# EAGLE schematic tiny2313 (EAGLE 6.5.0)
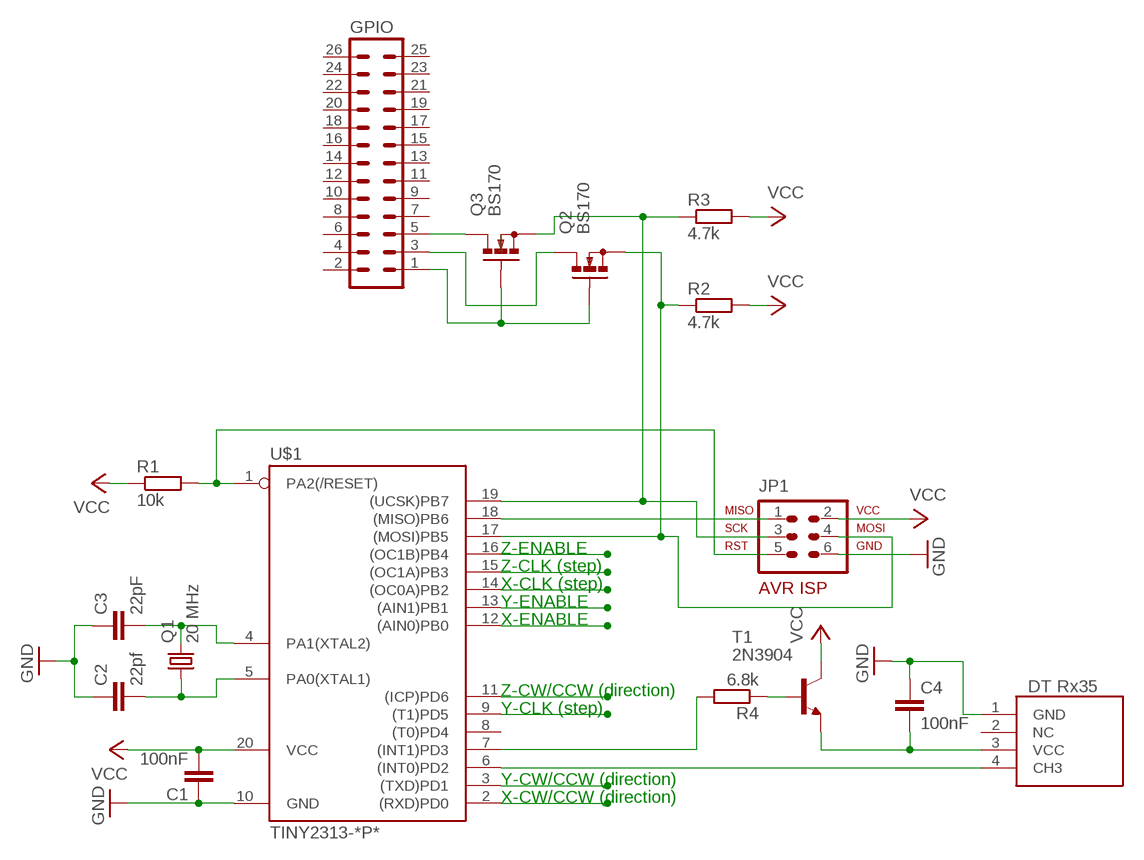
[diagram p0: schematic, sheet 1]

## Parts
C1  100nF  C2.5/2  [C2.5-2]
C2  22pf  C2.5/2  [C2.5-2]
C3  22pF  C2.5/2  [C2.5-2]
C4  100nF  C2.5/2  [C2.5-2]
GPIO  ML26  [ML26]
JP1  AVR-ISP-6VERT  [AVR-ISP-6]
Q1  20 MHz  CRYSTALHC49S  [HC49/S]
Q2  BS170  [SOT54E]
Q3  BS170  [SOT54E]
R1  10k  R-EU_0207/2V  [0207/2V]
R2  4.7k  R-EU_0207/2V  [0207/2V]
R3  4.7k  R-EU_0207/2V  [0207/2V]
R4  6.8k  R-EU_0207/12  [0207/12]
T1  2N3904  [TO92]
U$1  TINY2313-*P*  [DIL20]
U$2  DTRX35  [DTRX35]

## Nets
GND: C1.1 C2.1 C3.1 C4.1 JP1.6 U$1.10(GND) U$2.1(GND)
N$1: JP1.1 U$1.18((MISO)PB6)
N$2: GPIO.5 Q3.D
N$4: GPIO.3 Q2.D
N$5: GPIO.1 Q2.G Q3.G
N$6: U$1.9((T1)PD5)
N$7: U$1.14((OC0A)PB2)
N$8: U$1.15((OC1A)PB3)
N$9: U$1.16((OC1B)PB4)
N$10: U$1.13((AIN1)PB1)
N$11: U$1.12((AIN0)PB0)
N$12: U$1.11((ICP)PD6)
N$13: U$1.3((TXD)PD1)
N$14: U$1.2((RXD)PD0)
N$15: R4.1 T1.2(B)
N$16: JP1.4 Q2.S R2.1 U$1.17((MOSI)PB5)
N$17: C4.2 T1.3(E) U$2.3(VCC)
N$18: R4.2 U$1.7((INT1)PD3)
N$19: C3.2 Q1.2 U$1.4(PA1(XTAL2))
N$20: C2.2 Q1.1 U$1.5(PA0(XTAL1))
N$21: JP1.5 R1.2 U$1.1(PA2(/RESET))
N$22: U$1.6((INT0)PD2) U$2.4(CH3)
N$28: JP1.3 Q3.S R3.1 U$1.19((UCSK)PB7)
VCC: C1.2 JP1.2 R1.1 R2.2 R3.2 T1.1(C) U$1.20(VCC)
Unconnected: GPIO.2 GPIO.4 GPIO.6 GPIO.7 GPIO.8 GPIO.9 GPIO.10 GPIO.11 GPIO.12 GPIO.13 GPIO.14 GPIO.15 GPIO.16 GPIO.17 GPIO.18 GPIO.19 GPIO.20 GPIO.21 GPIO.22 GPIO.23 GPIO.24 GPIO.25 GPIO.26 U$1.8((T0)PD4) U$2.2(NC)

## Notes on the sheet
- Z-ENABLE
- Z-CLK (step)
- X-CLK (step)
- Y-ENABLE
- X-ENABLE
- Z-CW/CCW (direction)
- Y-CLK (step)
- Y-CW/CCW (direction)
- X-CW/CCW (direction)

## Library data of the parts
C1-C4 = capacitor-wima:C: CAPACITOR naming: grid - package width
GPIO = con-ml:ML26: HARTING; OC_FARNELL: unknown; OC_NEWARK: unknown
JP1 = avr-7:AVR-ISP-6: AVR ISP-6 Serial Programming Header
Q1 = crystal:CRYSTAL: CRYSTAL; OC_FARNELL: 1667008; OC_NEWARK: unknown
Q2 Q3 = transistor-small-signal:BS170: N-CHANNEL MOS FET
R1-R4 = resistor:R-EU_: RESISTOR, European symbol
T1 = transistor-npn:2N3904: NPN Transistor
U$1 = avr-7:TINY2313*: Atmel Tiny2313 2K Flash, 128 bytes EEPROM, 128 bytes RAM
U$2 = DTRX35:DTRX35